# EAGLE schematic IrrigationSystemShield (EAGLE 6.5.0)
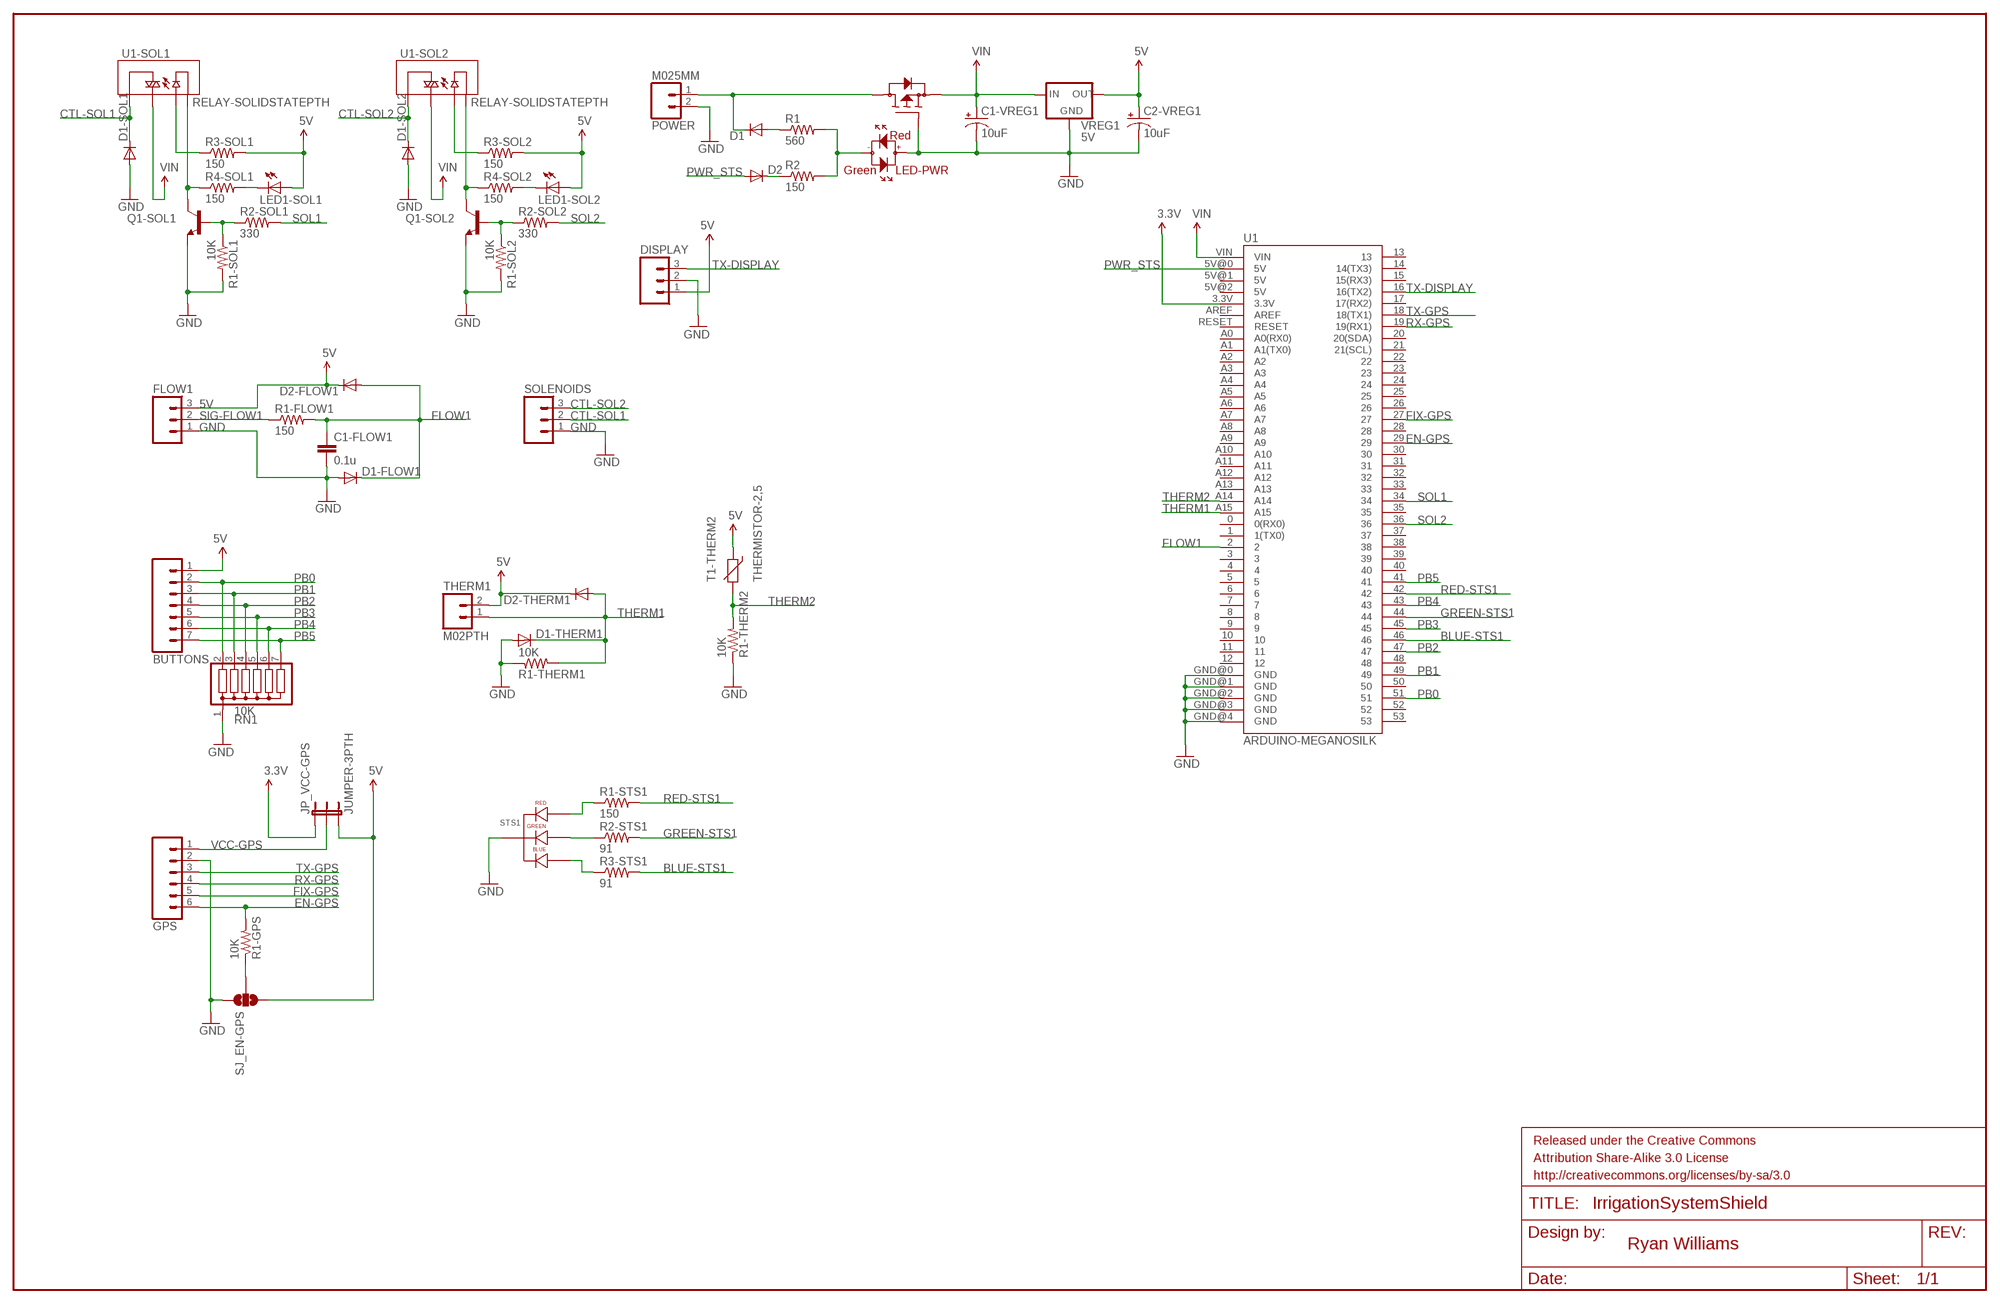
[diagram p0: schematic, sheet 1]

## Parts
BUTTONS  M07  [1X07]
C1-FLOW1  0.1u  CAPPTH1  [CAP-PTH-5MM]
C1-VREG1  10uF  10UF-25V-20%(PTH)  [CPOL-RADIAL-10UF-25V]
C2-VREG1  10uF  10UF-25V-20%(PTH)  [CPOL-RADIAL-10UF-25V]
D1  DIODEPTH  [DIODE-1N4001]
D1-FLOW1  DIODE1N4148  [DIODE-1N4148]
D1-SOL1  DIODEPTH  [DIODE-1N4001]
D1-SOL2  DIODEPTH  [DIODE-1N4001]
D1-THERM1  DIODE1N4148  [DIODE-1N4148]
D2  DIODEPTH  [DIODE-1N4001]
D2-FLOW1  DIODE1N4148  [DIODE-1N4148]
D2-THERM1  DIODE1N4148  [DIODE-1N4148]
DISPLAY  M03JST-PTH  [JST-3-PTH]
FET-1  P-FET  [FQP27P06]
FLOW1  M03-SCREW-5MM  [SCREWTERMINAL-5MM-3]
FRAME1  FRAME-LEDGER  [CREATIVE_COMMONS]
GPS  M06SIP  [1X06]
JP_VCC-GPS  JUMPER-3PTH  [1X03]
LED1-SOL1  LED5MM  [LED5MM]
LED1-SOL2  LED5MM  [LED5MM]
LED-PWR  LED-BIPOLARHGL*3362  [LED-5MM]
POWER  M025MM  [SCREWTERMINAL-5MM-2]
Q1-SOL1  TRANSISTOR_NPNTO92  [TO-92]
Q1-SOL2  TRANSISTOR_NPNTO92  [TO-92]
R1  560  RESISTORPTH-1/2W  [AXIAL-0.5]
R1-FLOW1  150  RESISTORPTH-1/4W  [AXIAL-0.4]
R1-GPS  10K  RESISTORPTH-1/4W  [AXIAL-0.4]
R1-SOL1  10K  RESISTORPTH-1/4W  [AXIAL-0.4]
R1-SOL2  10K  RESISTORPTH-1/4W  [AXIAL-0.4]
R1-STS1  150  RESISTORPTH-1/4W  [AXIAL-0.4]
R1-THERM1  10K  RESISTORPTH-1/4W  [AXIAL-0.4]
R1-THERM2  10K  RESISTORPTH-1/4W  [AXIAL-0.4]
R2  150  RESISTORPTH-1/4W  [AXIAL-0.4]
R2-SOL1  330  RESISTORPTH-1/4W  [AXIAL-0.4]
R2-SOL2  330  RESISTORPTH-1/4W  [AXIAL-0.4]
R2-STS1  91  RESISTORPTH-1/4W  [AXIAL-0.4]
R3-SOL1  150  RESISTORPTH-1/4W  [AXIAL-0.4]
R3-SOL2  150  RESISTORPTH-1/4W  [AXIAL-0.4]
R3-STS1  91  RESISTORPTH-1/4W  [AXIAL-0.4]
R4-SOL1  150  RESISTORPTH-1/4W  [AXIAL-0.4]
R4-SOL2  150  RESISTORPTH-1/4W  [AXIAL-0.4]
RN1  10K  G06R  [SIL7]
SJ_EN-GPS  SOLDERJUMPER_2WAYS  [SJ_3]
SOLENOIDS  M03-SCREW-5MM  [SCREWTERMINAL-5MM-3]
STS1  LED-RGB-CC-THRUDIFFUSE  [LED-RGB-THRU]
T1-THERM2  THERMISTOR-2,5  [RS-2,5]
THERM1  M02PTH  [1X02]
U1  ARDUINO-MEGANOSILK  [ARDUINO_MEGA_NOSILK]
U1-SOL1  RELAY-SOLIDSTATEPTH  [RELAY-S108T02]
U1-SOL2  RELAY-SOLIDSTATEPTH  [RELAY-S108T02]
VREG1  5V  V_REG_78XXSINK  [TO220-IGO]

## Nets
3.3V [Power]: JP_VCC-GPS.1 U1.3.3V
5V [Power]: BUTTONS.1 C2-VREG1.1(+) D2-FLOW1.C D2-THERM1.C DISPLAY.1 FLOW1.3 JP_VCC-GPS.3 LED1-SOL1.A LED1-SOL2.A R3-SOL1.P$2 R3-SOL2.P$2 SJ_EN-GPS.3 T1-THERM2.1 THERM1.2 VREG1.OUT
BLUE-STS1: R3-STS1.P$2 U1.46
CTL-SOL1: D1-SOL1.C SOLENOIDS.2 U1-SOL1.1(T1)
CTL-SOL2: D1-SOL2.C SOLENOIDS.3 U1-SOL2.1(T1)
EN-GPS: GPS.6 R1-GPS.P$2 U1.29
FIX-GPS: GPS.5 U1.27
FLOW1: C1-FLOW1.1 D1-FLOW1.C D2-FLOW1.A R1-FLOW1.P$2 U1.2
GND [Power]: C1-FLOW1.2 C1-VREG1.2(-) C2-VREG1.2(-) D1-FLOW1.A D1-SOL1.A D1-SOL2.A D1-THERM1.A DISPLAY.2 FET-1.GATE FLOW1.1 GPS.2 LED-PWR.ANODE POWER.2 Q1-SOL1.1(E) Q1-SOL2.1(E) R1-SOL1.P$2 R1-SOL2.P$2 R1-THERM1.P$1 R1-THERM2.P$1 RN1.1 SJ_EN-GPS.1 SOLENOIDS.1 STS1.2(CATHODE) U1.GND@0(GND) U1.GND@1(GND) U1.GND@2(GND) U1.GND@3(GND) U1.GND@4(GND) VREG1.GND
GREEN-STS1: R2-STS1.P$2 U1.44
N$1: Q1-SOL2.2(B) R1-SOL2.P$1 R2-SOL2.P$1
N$2: Q1-SOL1.2(B) R1-SOL1.P$1 R2-SOL1.P$1
N$3: LED1-SOL1.K(C) R4-SOL1.P$2
N$4: Q1-SOL1.3(C) R4-SOL1.P$1 U1-SOL1.4(-)
N$5: R3-SOL1.P$1 U1-SOL1.3(+)
N$6: LED1-SOL2.K(C) R4-SOL2.P$2
N$7: Q1-SOL2.3(C) R4-SOL2.P$1 U1-SOL2.4(-)
N$8: R3-SOL2.P$1 U1-SOL2.3(+)
N$9 [Power]: D1.C FET-1.DRAIN POWER.1
N$10: R1-STS1.P$1 STS1.1(RED_CATHODE)
N$11: R1-GPS.P$1 SJ_EN-GPS.2
N$12: R2-STS1.P$1 STS1.3(GREEN_CATHODE)
N$13: R3-STS1.P$1 STS1.4(BLUE_CATHODE)
N$14: D2.C R2.P$1
N$15: LED-PWR.CATHODE R1.P$2 R2.P$2
N$16: D1.A R1.P$1
PB0: BUTTONS.2 RN1.2 U1.51
PB1: BUTTONS.3 RN1.3 U1.49
PB2: BUTTONS.4 RN1.4 U1.47
PB3: BUTTONS.5 RN1.5 U1.45
PB4: BUTTONS.6 RN1.6 U1.43
PB5: BUTTONS.7 RN1.7 U1.41
PWR_STS: D2.A U1.5V@0(5V)
RED-STS1: R1-STS1.P$2 U1.42
RX-GPS: GPS.4 U1.19(19(RX1))
SIG-FLOW1: FLOW1.2 R1-FLOW1.P$1
SOL1: R2-SOL1.P$2 U1.34
SOL2: R2-SOL2.P$2 U1.36
THERM1: D1-THERM1.C D2-THERM1.A R1-THERM1.P$2 THERM1.1 U1.A15
THERM2: R1-THERM2.P$2 T1-THERM2.2 U1.A14
TX-DISPLAY: DISPLAY.3 U1.16(16(TX2))
TX-GPS: GPS.3 U1.18(18(TX1))
VCC-GPS: GPS.1 JP_VCC-GPS.2
VIN [Power]: C1-VREG1.1(+) FET-1.SOURCE U1-SOL1.2(T2) U1-SOL2.2(T2) U1.VIN VREG1.IN
Unconnected: U1.0(0(RX0)) U1.1(1(TX0)) U1.3 U1.4 U1.5 U1.5V@1(5V) U1.5V@2(5V) U1.6 U1.7 U1.8 U1.9 U1.10 U1.11 U1.12 U1.13 U1.14(14(TX3)) U1.15(15(RX3)) U1.17(17(RX2)) U1.20(20(SDA)) U1.21(21(SCL)) U1.22 U1.23 U1.24 U1.25 U1.26 U1.28 U1.30 U1.31 U1.32 U1.33 U1.35 U1.37 U1.38 U1.39 U1.40 U1.48 U1.50 U1.52 U1.53 U1.A0(A0(RX0)) U1.A1(A1(TX0)) U1.A2 U1.A3 U1.A4 U1.A5 U1.A6 U1.A7 U1.A8 U1.A9 U1.A10 U1.A11 U1.A12 U1.A13 U1.AREF U1.RESET

## Library data of the parts
BUTTONS = SparkFun-Connectors:M07: Header 7 Standard 7-pin 0.1" header. Use with straight break away headers (SKU : PRT-00116), right angle break away headers (PRT-00553), swiss pins (PRT-00743), machine pins (PRT-00117), and female headers (PRT-00115). NOTES ON THE VARIANTS LOCK and LOCK_LONGPADS... This footprint was designed to help hold the alignment of a through-hole component (i.e. 7-pin header) while soldering it into place. You may notice that each hole has been shifted either up or down by 0.005 of an inch from it's more standard position (which is usually a perfectly straight line). This slight alteration caused the pins (the squares in the middle) to touch the edges of the holes. Because they are alternating, it causes a "brace" to hold the header in place. 0.005 has proven to be the perfect amount of "off-center" position when using our standard breakaway headers. Although looks a little odd when you look at the bare footprint, once you have a header in there, the alteration is very hard to notice. Also, if you push a header all the way into place, it is covered up entirely on the bottom side. This idea of altering the position of holes to aid alignment will be further integrated into the Sparkfun Library for other footprints. It can help hold any component with 3 or more connection pins.
C1-FLOW1 = SparkFun-Capacitors:CAP: Capacitor Standard 0603 ceramic capacitor, and 0.1" leaded capacitor.
C1-VREG1 C2-VREG1 = SparkFun-Capacitors:10UF-25V-20%(PTH): CAP-08440; PROD_ID: CAP-08440
D1 D1-FLOW1 D1-SOL1 D1-SOL2 D1-THERM1 D2 D2-FLOW1 D2-THERM1 = SparkFun-DiscreteSemi:DIODE: Diode These are standard reverse protection diodes and small signal diodes. SMA package can handle up to about 1A. SOD-323 can handle about 200mA. What the SOD-323 package when ordering, there are some mfgs out there that are 5-pin packages.
DISPLAY FLOW1 SOLENOIDS = SparkFun-Connectors:M03: Header 3 Standard 3-pin 0.1" header. Use with straight break away headers (SKU : PRT-00116), right angle break away headers (PRT-00553), swiss pins (PRT-00743), machine pins (PRT-00117), and female headers (PRT-00115). Molex polarized connector foot print use with SKU : PRT-08232 with associated crimp pins and housings.
FET-1 = Library:P-FET
FRAME1 = SparkFun-Aesthetics:FRAME-LEDGER: Schematic Frame Standard 11x14 US Ledger frame
GPS = SparkFun-Connectors:M06: Header 6 Standard 6-pin 0.1" header. Use with straight break away headers (SKU : PRT-00116), right angle break away headers (PRT-00553), swiss pins (PRT-00743), machine pins (PRT-00117), and female headers (PRT-00115). Molex polarized connector foot print use with SKU : PRT-08094 with associated crimp pins and housings. NOTES ON THE VARIANTS LOCK and LOCK_LONGPADS... This footprint was designed to help hold the alignment of a through-hole component (i.e. 6-pin header) while soldering it into place. You may notice that each hole has been shifted either up or down by 0.005 of an inch from it's more standard position (which is a perfectly straight line). This slight alteration caused the pins (the squares in the middle) to touch the edges of the holes. Because they are alternating, it causes a "brace" to hold the component in place. 0.005 has proven to be the perfect amount of "off-center" position when using our standard breakaway headers. Although looks a little odd when you look at the bare footprint, once you have a header in there, the alteration is very hard to notice. Also,if you push a header all the way into place, it is covered up entirely on the bottom side. This idea of altering the position of holes to aid alignment will be further integrated into the Sparkfun Library for other footprints. It can help hold any component with 3 or more connection pins.
JP_VCC-GPS = SparkFun-Passives:JUMPER-3
LED1-SOL1 LED1-SOL2 = SparkFun-LED:LED: LEDs Standard schematic elements and footprints for 5mm, 3mm, 1206, and 0603 sized LEDs. 5mm - Spark Fun Electronics SKU : COM-00529 (and others)
LED-PWR = Library:LED-BIPOLAR; COLOR_FORWARD: Red; COLOR_REVERSE: Green
POWER THERM1 = SparkFun-Connectors:M02: Standard 2-pin 0.1" header. Use with - straight break away headers ( PRT-00116) - right angle break away headers (PRT-00553) - swiss pins (PRT-00743) - machine pins (PRT-00117) - female headers (PRT-00115) Molex polarized connector foot print use with: PRT-08233 with associated crimp pins and housings. 2.54_SCREWTERM for use with PRT-10571. 3.5mm Screw Terminal footprints for PRT-08084 5mm Screw Terminal footprints for use with PRT-08433
Q1-SOL1 Q1-SOL2 = SparkFun-DiscreteSemi:TRANSISTOR_NPN: Generic NPN BJT MMBT2222A - TRANS-08049 (SOT-23, 1A 40V) MPSA42 - TRANS-09116 (SOT-23, 500mA 300V) MMBT5088LT1G - TRANS-11160 (SOT-23, 50 mA 30V)
R1 R1-FLOW1 R1-GPS R1-SOL1 R1-SOL2 R1-STS1 R1-THERM1 R1-THERM2 R2 R2-SOL1 R2-SOL2 R2-STS1 R3-SOL1 R3-SOL2 R3-STS1 R4-SOL1 R4-SOL2 = SparkFun-Resistors:RESISTOR: Resistor Basic schematic elements and footprints for 0603, 1206, and PTH resistors.
RN1 = resistor-sil:G06R: SIL RESISTOR; OC_FARNELL: unknown; OC_NEWARK: unknown
SJ_EN-GPS = SparkFun-Passives:SOLDERJUMPER_2WAY: Solder Jumper 2 way solder jumper
STS1 = Library:LED-RGB-CC-THRU: RGB Through-hole common cathode LED SparkFun Storefront: COM-00105 (Clear) COM-09264 (Diffuse); PROD_ID: DIO-09434
T1-THERM2 = varistor:THERMISTOR: THERMISTOR
U1 = SparkFun-Boards:ARDUINO-MEGA: Arduino Mega board footprint
U1-SOL1 U1-SOL2 = SparkFun-Electromechanical:RELAY-SOLIDSTATE: SPST SS relay
VREG1 = SparkFun-PowerIC:V_REG_78XX: Voltage Regulator Standard 7805 5V regulator. IGO (Input Ground Output). Spark Fun Electronics SKU : COM-00107

## Net classes
1 Power: width 0.01 mm